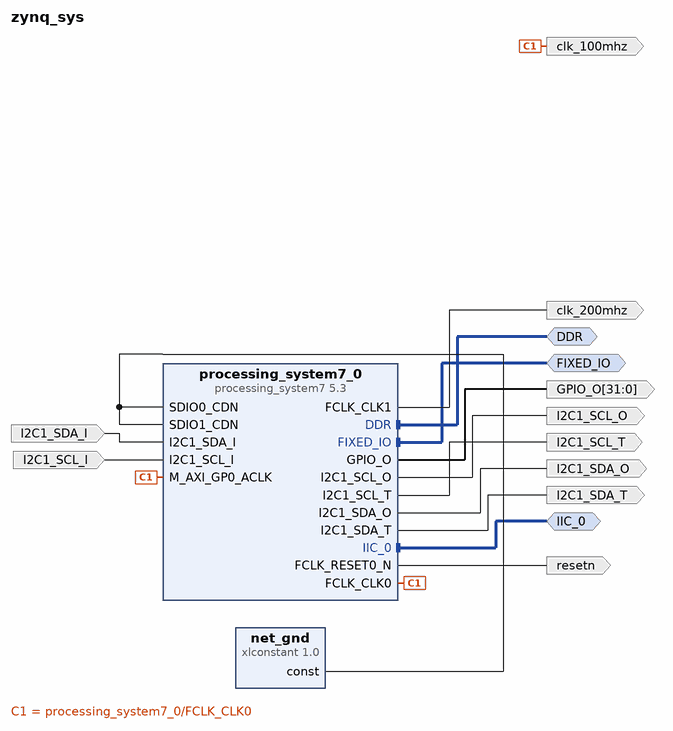
[diagram p0: block diagram of the top level]
# Vivado block design zynq_sys, Vivado 2013.4
create_bd_design zynq_sys

create_bd_intf_port -mode Master -vlnv xilinx.com:interface:ddrx_rtl:1.0 DDR
create_bd_intf_port -mode Master -vlnv xilinx.com:display_processing_system7:fixedio_rtl:1.0 FIXED_IO
create_bd_intf_port -mode Master -vlnv xilinx.com:interface:iic_rtl:1.0 IIC_0
create_bd_port -dir O -from 31 -to 0 GPIO_O
create_bd_port -dir I I2C1_SDA_I
create_bd_port -dir O I2C1_SDA_O
create_bd_port -dir O I2C1_SDA_T
create_bd_port -dir I I2C1_SCL_I
create_bd_port -dir O I2C1_SCL_O
create_bd_port -dir O I2C1_SCL_T
create_bd_port -dir O -type clk clk_100mhz
create_bd_port -dir O -type clk clk_200mhz
create_bd_port -dir O -type rst resetn

create_bd_cell -type ip -vlnv xilinx.com:ip:processing_system7:5.3 processing_system7_0
set_property -dict [list \
  CONFIG.PCW_SDIO_PERIPHERAL_FREQMHZ 50 \
  CONFIG.PCW_FPGA0_PERIPHERAL_FREQMHZ 100 \
  CONFIG.PCW_FPGA1_PERIPHERAL_FREQMHZ 200 \
  CONFIG.PCW_EN_CLK1_PORT 1 \
  CONFIG.PCW_PRESET_BANK1_VOLTAGE {LVCMOS 1.8V} \
  CONFIG.PCW_UIPARAM_DDR_PARTNO {MT41J256M16 RE-125} \
  CONFIG.PCW_QSPI_PERIPHERAL_ENABLE 1 \
  CONFIG.PCW_QSPI_GRP_FBCLK_ENABLE 1 \
  CONFIG.PCW_ENET0_PERIPHERAL_ENABLE 1 \
  CONFIG.PCW_ENET0_ENET0_IO {MIO 16 .. 27} \
  CONFIG.PCW_ENET0_GRP_MDIO_ENABLE 1 \
  CONFIG.PCW_SD0_PERIPHERAL_ENABLE 1 \
  CONFIG.PCW_SD0_GRP_CD_ENABLE 1 \
  CONFIG.PCW_SD1_PERIPHERAL_ENABLE 1 \
  CONFIG.PCW_SD1_SD1_IO {MIO 46 .. 51} \
  CONFIG.PCW_SD1_GRP_CD_ENABLE 1 \
  CONFIG.PCW_UART0_PERIPHERAL_ENABLE 1 \
  CONFIG.PCW_UART0_UART0_IO {MIO 14 .. 15} \
  CONFIG.PCW_TTC0_PERIPHERAL_ENABLE 1 \
  CONFIG.PCW_USB0_PERIPHERAL_ENABLE 1 \
  CONFIG.PCW_I2C0_PERIPHERAL_ENABLE 1 \
  CONFIG.PCW_I2C1_PERIPHERAL_ENABLE 1 \
  CONFIG.PCW_GPIO_MIO_GPIO_ENABLE 1 \
  CONFIG.PCW_GPIO_EMIO_GPIO_ENABLE 1 \
  CONFIG.PCW_GPIO_EMIO_GPIO_IO 32 \
] [get_bd_cells processing_system7_0]
# 84 more settings of processing_system7_0 are not shown: defaults, MIO pin electricals, DDR timing, and values the tool derives
create_bd_cell -type ip -vlnv xilinx.com:ip:xlconstant:1.0 net_gnd
set_property -dict {CONFIG.CONST_VAL 0} [get_bd_cells net_gnd]

# ---- connections ----

connect_bd_intf_net [get_bd_intf_ports DDR] [get_bd_intf_pins processing_system7_0/DDR]
connect_bd_intf_net [get_bd_intf_ports FIXED_IO] [get_bd_intf_pins processing_system7_0/FIXED_IO]
connect_bd_intf_net [get_bd_intf_ports IIC_0] [get_bd_intf_pins processing_system7_0/IIC_0]
connect_bd_net [get_bd_pins processing_system7_0/GPIO_O] [get_bd_ports GPIO_O]
connect_bd_net [get_bd_ports I2C1_SDA_I] [get_bd_pins processing_system7_0/I2C1_SDA_I]
connect_bd_net [get_bd_pins processing_system7_0/I2C1_SDA_O] [get_bd_ports I2C1_SDA_O]
connect_bd_net [get_bd_pins processing_system7_0/I2C1_SDA_T] [get_bd_ports I2C1_SDA_T]
connect_bd_net [get_bd_ports I2C1_SCL_I] [get_bd_pins processing_system7_0/I2C1_SCL_I]
connect_bd_net [get_bd_pins processing_system7_0/I2C1_SCL_O] [get_bd_ports I2C1_SCL_O]
connect_bd_net [get_bd_pins processing_system7_0/I2C1_SCL_T] [get_bd_ports I2C1_SCL_T]
connect_bd_net [get_bd_pins net_gnd/const] [get_bd_pins processing_system7_0/SDIO0_CDN] [get_bd_pins processing_system7_0/SDIO1_CDN]
connect_bd_net [get_bd_pins processing_system7_0/FCLK_CLK0] [get_bd_ports clk_100mhz] [get_bd_pins processing_system7_0/M_AXI_GP0_ACLK]
connect_bd_net [get_bd_pins processing_system7_0/FCLK_CLK1] [get_bd_ports clk_200mhz]
connect_bd_net [get_bd_pins processing_system7_0/FCLK_RESET0_N] [get_bd_ports resetn]

validate_bd_design
save_bd_design
